# EAGLE design Token (EAGLE 6.5.0)
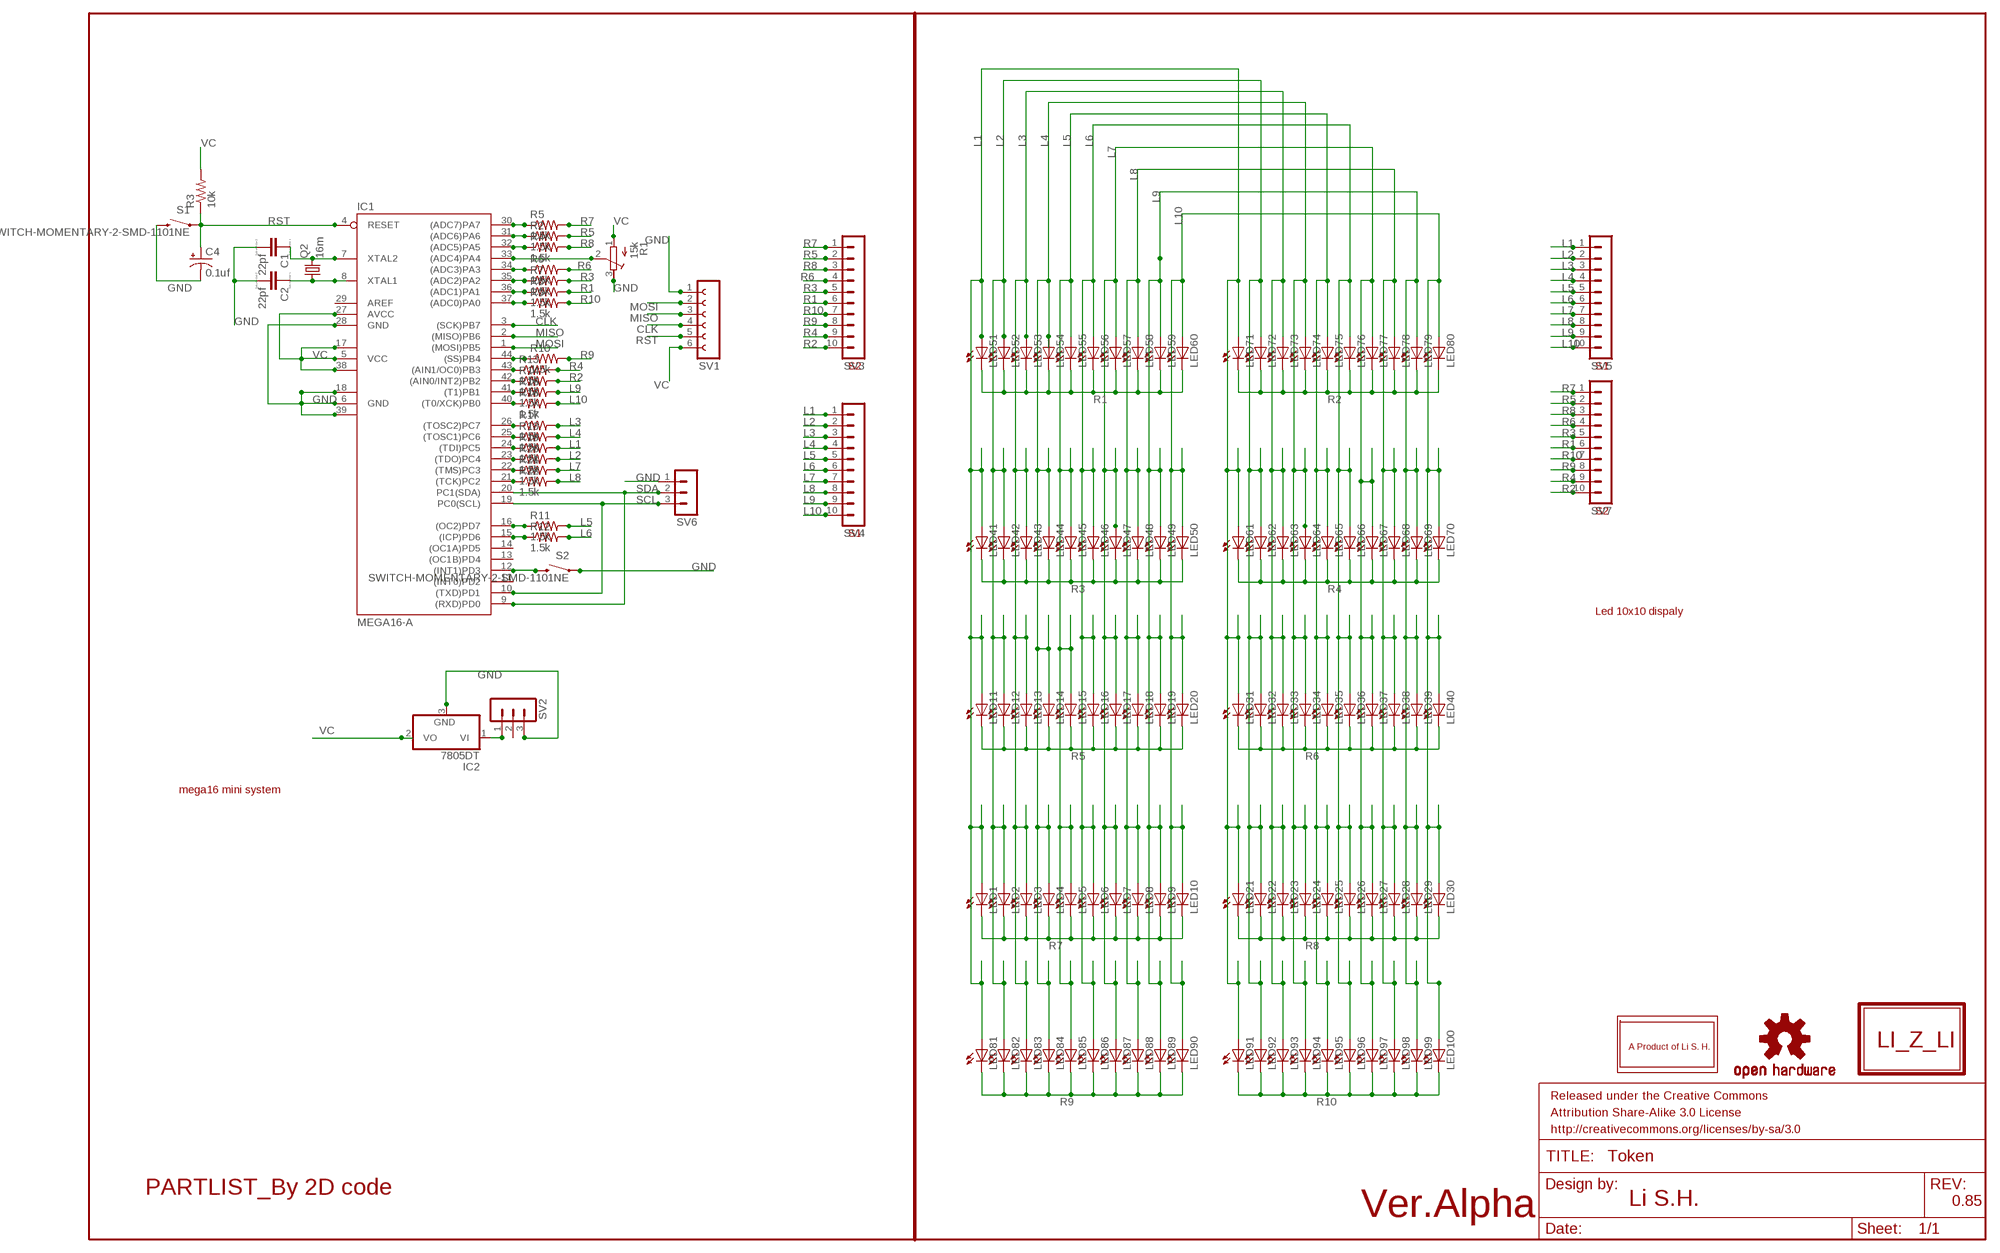
[diagram p0: schematic, sheet 1]

## Parts
C1  22pf  CC0402  [C0402]
C2  22pf  CC0402  [C0402]
C4  0.1uf  CPOL-USD/7343-31W  [D/7343-31W]
FRAME1  FRAME-LEDGER  [CREATIVE_COMMONS]
IC1  MEGA16-A  [TQFP44]
IC2  7805DT  [TO252]
LED1  LEDCHIPLED_0805  [CHIPLED_0805]
LED2  LEDCHIPLED_0805  [CHIPLED_0805]
LED3  LEDCHIPLED_0805  [CHIPLED_0805]
LED4  LEDCHIPLED_0805  [CHIPLED_0805]
LED5  LEDCHIPLED_0805  [CHIPLED_0805]
LED6  LEDCHIPLED_0805  [CHIPLED_0805]
LED7  LEDCHIPLED_0805  [CHIPLED_0805]
LED8  LEDCHIPLED_0805  [CHIPLED_0805]
LED9  LEDCHIPLED_0805  [CHIPLED_0805]
LED10  LEDCHIPLED_0805  [CHIPLED_0805]
LED11  LEDCHIPLED_0805  [CHIPLED_0805]
LED12  LEDCHIPLED_0805  [CHIPLED_0805]
LED13  LEDCHIPLED_0805  [CHIPLED_0805]
LED14  LEDCHIPLED_0805  [CHIPLED_0805]
LED15  LEDCHIPLED_0805  [CHIPLED_0805]
LED16  LEDCHIPLED_0805  [CHIPLED_0805]
LED17  LEDCHIPLED_0805  [CHIPLED_0805]
LED18  LEDCHIPLED_0805  [CHIPLED_0805]
LED19  LEDCHIPLED_0805  [CHIPLED_0805]
LED20  LEDCHIPLED_0805  [CHIPLED_0805]
LED21  LEDCHIPLED_0805  [CHIPLED_0805]
LED22  LEDCHIPLED_0805  [CHIPLED_0805]
LED23  LEDCHIPLED_0805  [CHIPLED_0805]
LED24  LEDCHIPLED_0805  [CHIPLED_0805]
LED25  LEDCHIPLED_0805  [CHIPLED_0805]
LED26  LEDCHIPLED_0805  [CHIPLED_0805]
LED27  LEDCHIPLED_0805  [CHIPLED_0805]
LED28  LEDCHIPLED_0805  [CHIPLED_0805]
LED29  LEDCHIPLED_0805  [CHIPLED_0805]
LED30  LEDCHIPLED_0805  [CHIPLED_0805]
LED31  LEDCHIPLED_0805  [CHIPLED_0805]
LED32  LEDCHIPLED_0805  [CHIPLED_0805]
LED33  LEDCHIPLED_0805  [CHIPLED_0805]
LED34  LEDCHIPLED_0805  [CHIPLED_0805]
LED35  LEDCHIPLED_0805  [CHIPLED_0805]
LED36  LEDCHIPLED_0805  [CHIPLED_0805]
LED37  LEDCHIPLED_0805  [CHIPLED_0805]
LED38  LEDCHIPLED_0805  [CHIPLED_0805]
LED39  LEDCHIPLED_0805  [CHIPLED_0805]
LED40  LEDCHIPLED_0805  [CHIPLED_0805]
LED41  LEDCHIPLED_0805  [CHIPLED_0805]
LED42  LEDCHIPLED_0805  [CHIPLED_0805]
LED43  LEDCHIPLED_0805  [CHIPLED_0805]
LED44  LEDCHIPLED_0805  [CHIPLED_0805]
LED45  LEDCHIPLED_0805  [CHIPLED_0805]
LED46  LEDCHIPLED_0805  [CHIPLED_0805]
LED47  LEDCHIPLED_0805  [CHIPLED_0805]
LED48  LEDCHIPLED_0805  [CHIPLED_0805]
LED49  LEDCHIPLED_0805  [CHIPLED_0805]
LED50  LEDCHIPLED_0805  [CHIPLED_0805]
LED51  LEDCHIPLED_0805  [CHIPLED_0805]
LED52  LEDCHIPLED_0805  [CHIPLED_0805]
LED53  LEDCHIPLED_0805  [CHIPLED_0805]
LED54  LEDCHIPLED_0805  [CHIPLED_0805]
LED55  LEDCHIPLED_0805  [CHIPLED_0805]
LED56  LEDCHIPLED_0805  [CHIPLED_0805]
LED57  LEDCHIPLED_0805  [CHIPLED_0805]
LED58  LEDCHIPLED_0805  [CHIPLED_0805]
LED59  LEDCHIPLED_0805  [CHIPLED_0805]
LED60  LEDCHIPLED_0805  [CHIPLED_0805]
LED61  LEDCHIPLED_0805  [CHIPLED_0805]
LED62  LEDCHIPLED_0805  [CHIPLED_0805]
LED63  LEDCHIPLED_0805  [CHIPLED_0805]
LED64  LEDCHIPLED_0805  [CHIPLED_0805]
LED65  LEDCHIPLED_0805  [CHIPLED_0805]
LED66  LEDCHIPLED_0805  [CHIPLED_0805]
LED67  LEDCHIPLED_0805  [CHIPLED_0805]
LED68  LEDCHIPLED_0805  [CHIPLED_0805]
LED69  LEDCHIPLED_0805  [CHIPLED_0805]
LED70  LEDCHIPLED_0805  [CHIPLED_0805]
LED71  LEDCHIPLED_0805  [CHIPLED_0805]
LED72  LEDCHIPLED_0805  [CHIPLED_0805]
LED73  LEDCHIPLED_0805  [CHIPLED_0805]
LED74  LEDCHIPLED_0805  [CHIPLED_0805]
LED75  LEDCHIPLED_0805  [CHIPLED_0805]
LED76  LEDCHIPLED_0805  [CHIPLED_0805]
LED77  LEDCHIPLED_0805  [CHIPLED_0805]
LED78  LEDCHIPLED_0805  [CHIPLED_0805]
LED79  LEDCHIPLED_0805  [CHIPLED_0805]
LED80  LEDCHIPLED_0805  [CHIPLED_0805]
LED81  LEDCHIPLED_0805  [CHIPLED_0805]
LED82  LEDCHIPLED_0805  [CHIPLED_0805]
LED83  LEDCHIPLED_0805  [CHIPLED_0805]
LED84  LEDCHIPLED_0805  [CHIPLED_0805]
LED85  LEDCHIPLED_0805  [CHIPLED_0805]
LED86  LEDCHIPLED_0805  [CHIPLED_0805]
LED87  LEDCHIPLED_0805  [CHIPLED_0805]
LED88  LEDCHIPLED_0805  [CHIPLED_0805]
LED89  LEDCHIPLED_0805  [CHIPLED_0805]
LED90  LEDCHIPLED_0805  [CHIPLED_0805]
LED91  LEDCHIPLED_0805  [CHIPLED_0805]
LED92  LEDCHIPLED_0805  [CHIPLED_0805]
LED93  LEDCHIPLED_0805  [CHIPLED_0805]
LED94  LEDCHIPLED_0805  [CHIPLED_0805]
LED95  LEDCHIPLED_0805  [CHIPLED_0805]
LED96  LEDCHIPLED_0805  [CHIPLED_0805]
LED97  LEDCHIPLED_0805  [CHIPLED_0805]
LED98  LEDCHIPLED_0805  [CHIPLED_0805]
LED99  LEDCHIPLED_0805  [CHIPLED_0805]
LED100  LEDCHIPLED_0805  [CHIPLED_0805]
LOGO1  OSHW-LOGOS  [OSHW-LOGO-S]
Q2  16m  CRYSTALHC49UP  [HC49UP]
R1  15k  R-TRIMM64W  [RTRIM64W]
R2  1.5k  R-US_R0201  [R0201]
R3  10k  R-US_R0201  [R0201]
R4  1.5k  R-US_R0201  [R0201]
R5  1.5k  R-US_R0201  [R0201]
R6  1.5k  R-US_R0201  [R0201]
R7  1.5k  R-US_R0201  [R0201]
R8  1.5k  R-US_R0201  [R0201]
R9  1.5k  R-US_R0201  [R0201]
R10  1.5k  R-US_R0201  [R0201]
R11  1.5k  R-US_R0201  [R0201]
R12  1.5k  R-US_R0201  [R0201]
R13  1.5k  R-US_R0201  [R0201]
R14  1.5k  R-US_R0201  [R0201]
R15  1.5k  R-US_R0201  [R0201]
R16  1.5k  R-US_R0201  [R0201]
R17  1.5k  R-US_R0201  [R0201]
R18  1.5k  R-US_R0201  [R0201]
R19  1.5k  R-US_R0201  [R0201]
R20  1.5k  R-US_R0201  [R0201]
R21  1.5k  R-US_R0201  [R0201]
R22  1.5k  R-US_R0201  [R0201]
S1  SWITCH-MOMENTARY-2-SMD-1101NE  [TACTILE-SWITCH-1101NE]
S2  SWITCH-MOMENTARY-2-SMD-1101NE  [TACTILE-SWITCH-1101NE]
SV1  FE06-1  [FE06]
SV2  MA03-1  [MA03-1]
SV3  MA10-1  [MA10-1]
SV4  MA10-1  [MA10-1]
SV5  MA10-1  [MA10-1]
SV6  MA03-1  [MA03-1]
SV7  MA10-1  [MA10-1]
U$1  NO1  [NO1]
U$2  NO2  [NO2]
U$3  VERALPHA  [VERALPHA]
U$4  PARTIST-2DCODE  [PARTLIST-2DCODE]

## Nets
CLK: IC1.3((SCK)PB7) SV1.4
GND: C1.2 C2.2 C4.- IC1.6(GND) IC1.18(GND1) IC1.28(GND) IC1.39(GND2) IC2.3(GND) R1.3(A) S1.P$2 S2.P$1 SV1.1 SV2.3 SV6.1
L1: LED1.A LED11.A LED21.A LED31.A LED41.A LED51.A LED61.A LED71.A LED81.A LED91.A SV5.1
L2: LED2.A LED12.A LED22.A LED32.A LED42.A LED52.A LED62.A LED72.A LED82.A LED92.A SV5.2
L3: LED3.A LED13.A LED23.A LED33.A LED43.A LED53.A LED63.A LED73.A LED83.A LED93.A SV5.3
L4: LED4.A LED14.A LED24.A LED34.A LED44.A LED54.A LED64.A LED74.A LED84.A LED94.A SV5.4
L5: LED5.A LED15.A LED25.A LED35.A LED45.A LED55.A LED65.A LED75.A LED85.A LED95.A SV5.5
L6: LED6.A LED16.A LED26.A LED36.A LED46.A LED56.A LED66.A LED76.A LED86.A LED96.A SV5.6
L7: LED7.A LED17.A LED27.A LED37.A LED47.A LED57.A LED67.A LED77.A LED87.A LED97.A SV5.7
L8: LED8.A LED18.A LED28.A LED38.A LED48.A LED58.A LED68.A LED78.A LED88.A LED98.A SV5.8
L9: LED9.A LED19.A LED29.A LED39.A LED49.A LED59.A LED69.A LED79.A LED89.A LED99.A SV5.9
L10: LED10.A LED20.A LED30.A LED40.A LED50.A LED60.A LED70.A LED80.A LED90.A LED100.A SV5.10
MISO: IC1.2((MISO)PB6) SV1.3
MOSI: IC1.1((MOSI)PB5) SV1.2
N$1: IC1.30((ADC7)PA7) R5.1
N$2: IC1.43((AIN1/OC0)PB3) R13.1
N$3: IC1.42((AIN0/INT2)PB2) R14.1
N$4: IC1.41((T1)PB1) R15.1
N$5: IC1.31((ADC6)PA6) R2.1
N$6: IC1.32((ADC5)PA5) R4.1
N$7: IC1.33((ADC4)PA4) R1.2(S)
N$8: IC1.34((ADC3)PA3) R6.1
N$9: C2.1 IC1.8(XTAL1) Q2.1
N$10: C1.1 IC1.7(XTAL2) Q2.2
N$11: IC1.35((ADC2)PA2) R7.1
N$12: IC1.36((ADC1)PA1) R8.1
N$13: IC2.1(VI) SV2.1
N$14: IC1.37((ADC0)PA0) R9.1
N$15: IC1.12((INT1)PD3) S2.P$2
N$16: IC1.44((SS)PB4) R10.1
N$17: IC1.16((OC2)PD7) R11.1
N$18: IC1.15((ICP)PD6) R12.1
N$19: IC1.40((T0/XCK)PB0) R16.1
N$20: IC1.26((TOSC2)PC7) R17.1
N$21: IC1.25((TOSC1)PC6) R18.1
N$22: IC1.24((TDI)PC5) R19.1
N$23: IC1.23((TDO)PC4) R20.1
N$24: IC1.22((TMS)PC3) R21.1
N$25: IC1.21((TCK)PC2) R22.1
N$30: R5.2 SV3.1
N$31: R2.2 SV3.2
N$32: R4.2 SV3.3
N$33: R6.2 SV3.4
N$34: R7.2 SV3.5
N$35: R8.2 SV3.6
N$36: R9.2 SV3.7
N$37: R10.2 SV3.8
N$38: R13.2 SV3.9
N$39: R14.2 SV3.10
N$40: R15.2 SV4.9
N$41: R16.2 SV4.10
N$42: R17.2 SV4.3
N$43: R18.2 SV4.4
N$44: R19.2 SV4.1
N$45: R20.2 SV4.2
N$46: R21.2 SV4.7
N$47: R22.2 SV4.8
N$48: R11.2 SV4.5
N$49: R12.2 SV4.6
R1: LED51.C LED52.C LED53.C LED54.C LED55.C LED56.C LED57.C LED58.C LED59.C LED60.C SV7.6
R2: LED71.C LED72.C LED73.C LED74.C LED75.C LED76.C LED77.C LED78.C LED79.C LED80.C SV7.10
R3: LED41.C LED42.C LED43.C LED44.C LED45.C LED46.C LED47.C LED48.C LED49.C LED50.C SV7.5
R4: LED61.C LED62.C LED63.C LED64.C LED65.C LED66.C LED67.C LED68.C LED69.C LED70.C SV7.9
R5: LED11.C LED12.C LED13.C LED14.C LED15.C LED16.C LED17.C LED18.C LED19.C LED20.C SV7.2
R6: LED31.C LED32.C LED33.C LED34.C LED35.C LED36.C LED37.C LED38.C LED39.C LED40.C SV7.4
R7: LED1.C LED2.C LED3.C LED4.C LED5.C LED6.C LED7.C LED8.C LED9.C LED10.C SV7.1
R8: LED21.C LED22.C LED23.C LED24.C LED25.C LED26.C LED27.C LED28.C LED29.C LED30.C SV7.3
R9: LED81.C LED82.C LED83.C LED84.C LED85.C LED86.C LED87.C LED88.C LED89.C LED90.C SV7.8
R10: LED91.C LED92.C LED93.C LED94.C LED95.C LED96.C LED97.C LED98.C LED99.C LED100.C SV7.7
RST: C4.+ IC1.4(RESET) R3.1 S1.P$1 SV1.5
SCL: IC1.10((TXD)PD1) IC1.19(PC0(SCL)) SV6.3
SDA: IC1.9((RXD)PD0) IC1.20(PC1(SDA)) SV6.2
VC: IC1.5(VCC) IC1.17(VCC1) IC1.27(AVCC) IC1.38(VCC2) IC2.2(VO) R1.1(E) R3.2 SV1.6
Unconnected: IC1.11((INT0)PD2) IC1.13((OC1B)PD4) IC1.14((OC1A)PD5) IC1.29(AREF) SV2.2

## Notes on the sheet
- S2 | S1
- S2
- S1
- Led 10x10 dispaly
- mega16 mini system
- Li S.H. | 0.85

## Library data of the parts
C1 C2 = eagle-ltspice:C: CAPACITOR, European symbol; SPICEMODEL: NONE; SPICEPREFIX: C
C4 = adafruit:CPOL-US: POLARIZED CAPACITOR, American symbol
FRAME1 = SparkFun-Aesthetics:FRAME-LEDGER: Schematic Frame Standard 11x14 US Ledger frame
IC1 = atmel:MEGA16: MICROCONTROLLER 16 Kbytes FLASH 1 kbytes SRAM 512 bytes EEPROM USART 8-channel 10 bit ADC Source: avr.lbr; MPN: ATMEGA16-16AU; OC_FARNELL: 9171134; OC_NEWARK: 96K6515
IC2 = adafruit:78*: Positive VOLTAGE REGULATOR Added bigger pads to the TO-92 package
LED1-LED100 = led:LED: LED OSRAM: - CHIPLED LG R971, LG N971, LY N971, LG Q971, LY Q971, LO R971, LY R971 LH N974, LH R974 LS Q976, LO Q976, LY Q976 LO Q996 - Hyper CHIPLED LW Q18S LB Q993, LB Q99A, LB R99A - SideLED LS A670, LO A670, LY A670, LG A670, LP A670 LB A673, LV A673, LT A673, LW A673 LH A674 LY A675 LS A676, LA A676, LO A676, LY A676, LW A676 LS A679, LY A679, LG A679 - Hyper Micro SIDELED® LS Y876, LA Y876, LO Y876, LY Y876 LT Y87S - SmartLED LW L88C, LW L88S LB L89C, LB L89S, LG L890 LS L89K, LO L89K, LY L89K LS L896, LA L896, LO L896, LY L896 - TOPLED LS T670, LO T670, LY T670, LG T670, LP T670 LSG T670, LSP T670, LSY T670, LOP T670, LYG T670 LG T671, LOG T671, LSG T671 LB T673, LV T673, LT T673, LW T673 LH T674 LS T676, LA T676, LO T676, LY T676, LB T676, LH T676, LSB T676, LW T676 LB T67C, LV T67C, LT T67C, LS T67K, LO T67K, LY T67K, LW E67C LS E67B, LA E67B, LO E67B, LY E67B, LB E67C, LV E67C, LT E67C LW T67C LS T679, LY T679, LG T679 LS T770, LO T770, LY T770, LG T770, LP T770 LB T773, LV T773, LT T773, LW T773 LH T774 LS E675, LA E675, LY E675, LS T675 LS T776, LA T776, LO T776, LY T776, LB T776 LHGB T686 LT T68C, LB T68C - Hyper Mini TOPLED® LB M676 - Mini TOPLED Santana® LG M470 LS M47K, LO M47K, LY M47K Source: http://www.osram.convergy.de LUXEON: - LUMILED® LXK2-PW12-R00, LXK2-PW12-S00, LXK2-PW14-U00, LXK2-PW14-V00 LXK2-PM12-R00, LXK2-PM12-S00, LXK2-PM14-U00 LXK2-PE12-Q00, LXK2-PE12-R00, LXK2-PE12-S00, LXK2-PE14-T00, LXK2-PE14-U00 LXK2-PB12-K00, LXK2-PB12-L00, LXK2-PB12-M00, LXK2-PB14-N00, LXK2-PB14-P00, LXK2-PB14-Q00 LXK2-PR12-L00, LXK2-PR12-M00, LXK2-PR14-Q00, LXK2-PR14-R00 LXK2-PD12-Q00, LXK2-PD12-R00, LXK2-PD12-S00 LXK2-PH12-R00, LXK2-PH12-S00 LXK2-PL12-P00, LXK2-PL12-Q00, LXK2-PL12-R00 Source: www.luxeon.com KINGBRIGHT: KA-3528ASYC Source: www.kingbright.com
LOGO1 = SparkFun-Aesthetics:OSHW-LOGO: Open Source Hardware Logo This logo indicates the piece of hardware it is found on incorporates a OSHW license and/or adheres to the definition of open source hardware found here: http://freedomdefined.org/OSHW
Q2 = crystal:CRYSTAL: CRYSTAL; OC_FARNELL: unknown; OC_NEWARK: unknown
R1 = resistor:R-TRIMM: Trimm resistor
R2-R22 = rcl:R-US_: RESISTOR, American symbol
S1 S2 = SparkFun-Electromechanical:SWITCH-MOMENTARY-2: Various NO switches- pushbuttons, reed, etc
SV1 = con-lsta:FE06-1: FEMALE HEADER; OC_FARNELL: unknown; OC_NEWARK: unknown
SV2 SV6 = con-lstb:MA03-1: PIN HEADER; OC_FARNELL: unknown; OC_NEWARK: unknown
SV3-SV5 SV7 = con-lstb:MA10-1: PIN HEADER; OC_FARNELL: unknown; OC_NEWARK: unknown
U$1 = logo_self:NO1
U$2 = logo_self:NO2
U$3 = logo_self:VERALPHA
U$4 = 2Dcode:PARTIST-2DCODE

## Board
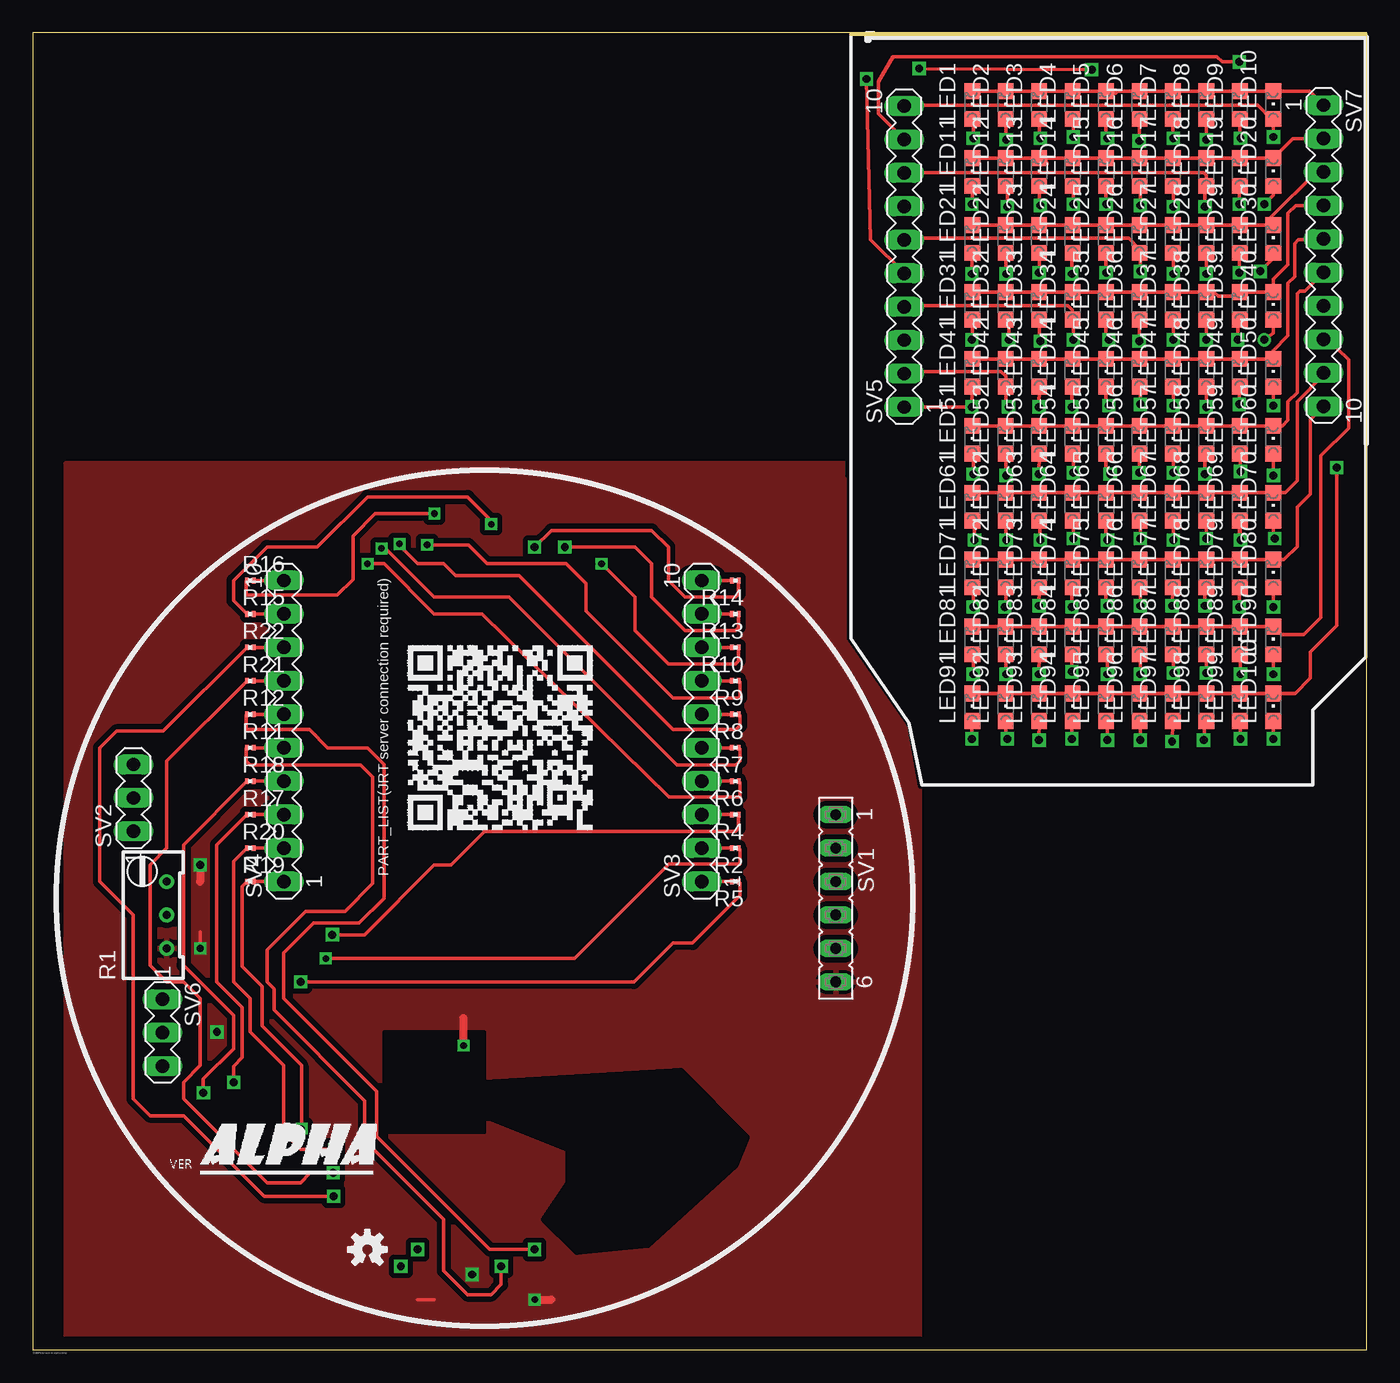
[diagram p1: board, top side]
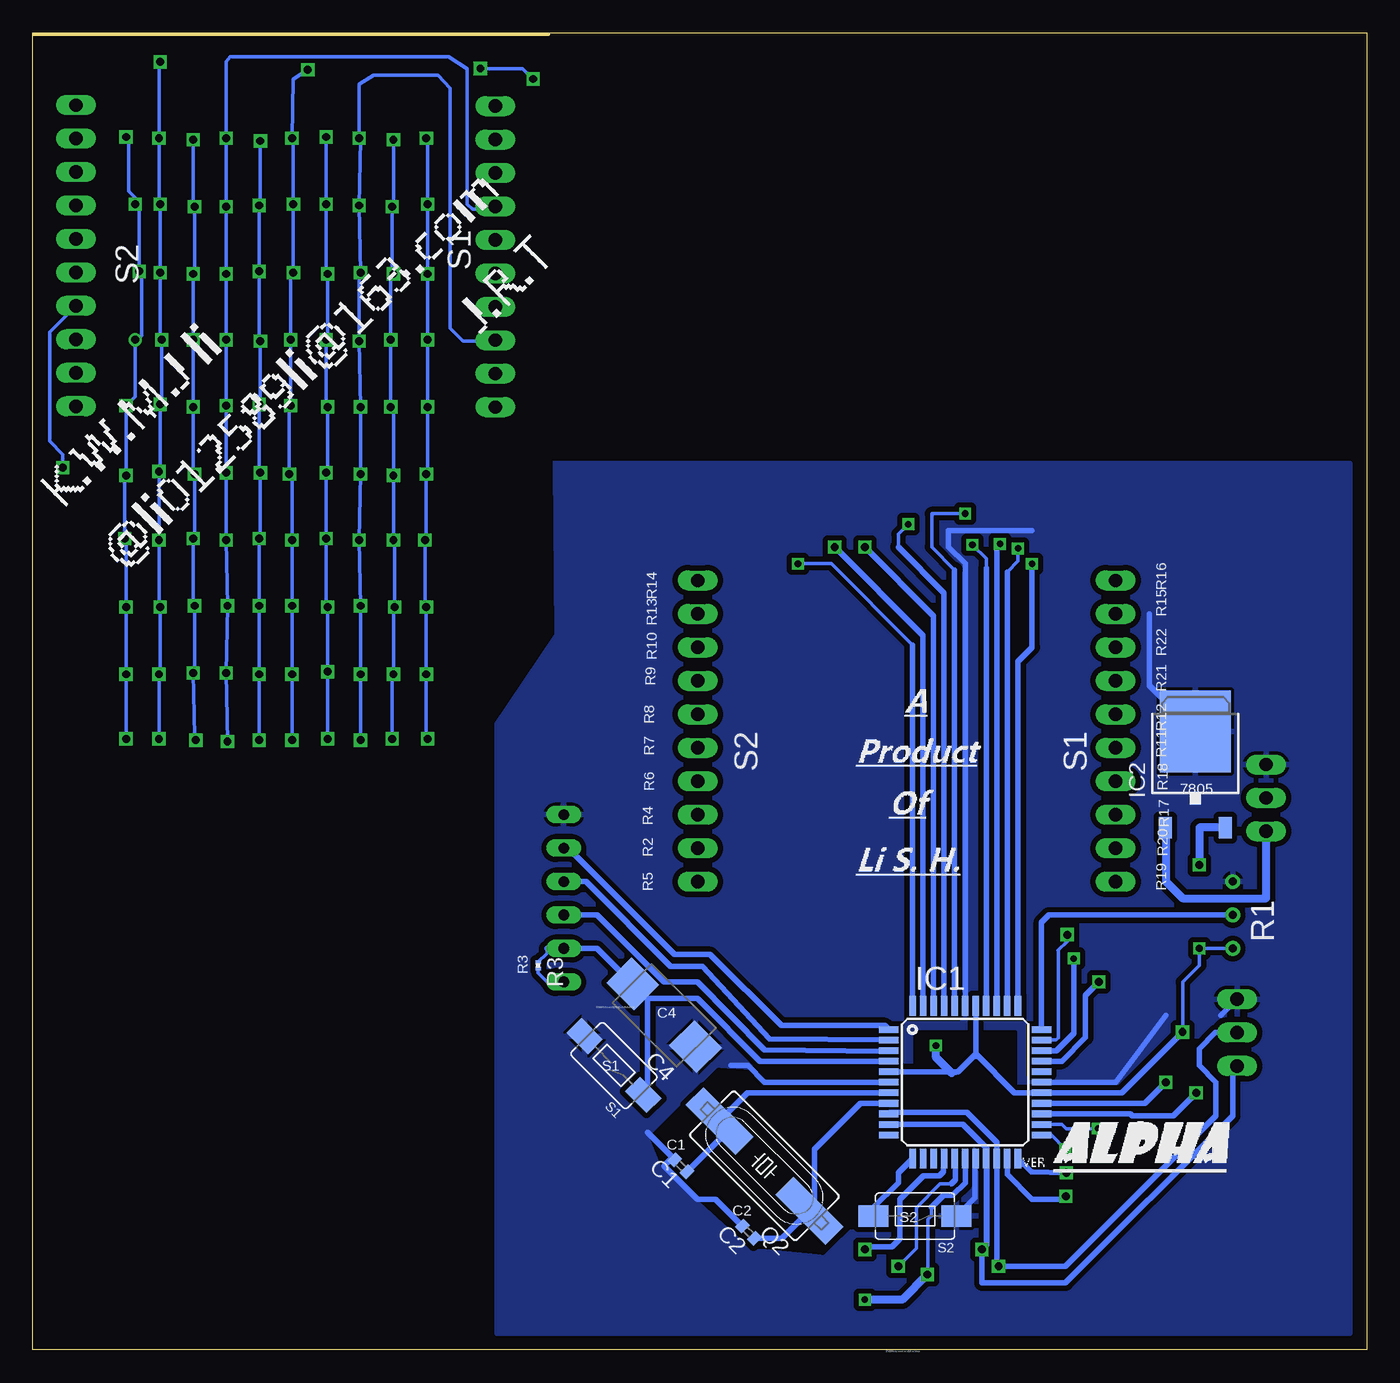
[diagram p2: board, bottom side, seen from below]

Size 101.27 x 100 mm. Coordinates in mm from the lower left corner, seen from the top.
Outline: 62.1,99.9 101.2,99.9
Outline: 0,0 101.27,0 101.27,100 0,100 0,0
Copper layers (1*16): Top 0.035mm / dielectric 1.5mm / Bottom 0.035mm
Design rules "default": minimum track width 10mil, minimum drill 24mil, track to track 8mil, track to pad 8mil, pad to pad 8mil, via to via 8mil, smd to smd 8mil, copper to edge 40mil, drill to drill 8mil, minimum pad ring 10mil, minimum via ring 8mil, stop-mask expansion 4mil, vias tented up to drill 0mil, thermal gap 10mil

### Footprints (pad centres in the part's own frame; a part is rotated, then mirrored left to right if it is on the bottom)
C0402 = smd 0.7 x 0.9: 1 -0.65,0; 2 0.65,0
D/7343-31W = smd 2.95 x 2.7: + 3.375,0; - -3.375,0
TQFP44 = smd 1.5 x 0.5: 1 -5.8,4; 2 -5.8,3.2; 3 -5.8,2.4; 4 -5.8,1.6; 5 -5.8,0.8; 6 -5.8,0; 7 -5.8,-0.8; 8 -5.8,-1.6; 9 -5.8,-2.4; 10 -5.8,-3.2; 11 -5.8,-4; 23 5.8,-4; 24 5.8,-3.2; 25 5.8,-2.4; 26 5.8,-1.6; 27 5.8,-0.8; 28 5.8,0; 29 5.8,0.8; 30 5.8,1.6; 31 5.8,2.4; 32 5.8,3.2; 33 5.8,4 | smd 0.5 x 1.5: 12 -4,-5.8; 13 -3.2,-5.8; 14 -2.4,-5.8; 15 -1.6,-5.8; 16 -0.8,-5.8; 17 0,-5.8; 18 0.8,-5.8; 19 1.6,-5.8; 20 2.4,-5.8; 21 3.2,-5.8; 22 4,-5.8; 34 4,5.8; 35 3.2,5.8; 36 2.4,5.8; 37 1.6,5.8; 38 0.8,5.8; 39 0,5.8; 40 -0.8,5.8; 41 -1.6,5.8; 42 -2.4,5.8; 43 -3.2,5.8; 44 -4,5.8
TO252 = smd 1 x 1.6: 1 -2.28,-4.8; 2 2.28,-4.8 | smd 5.4 x 6.2: 3 0,2.5
CHIPLED_0805 = smd 1.2 x 1.2: A 0,-1.05; C 0,1.05
HC49UP = smd 5.334 x 1.93: 1 -4.826,0; 2 4.826,0
RTRIM64W = drill 0.61: 1 1.27,-2.54; 2 1.27,0; 3 1.27,2.54
R0201 = smd 0.28 x 0.43: 1 -0.255,0; 2 0.255,0
TACTILE-SWITCH-1101NE = smd 2.3 x 1.6: P$1 -3.15,0; P$2 3.15,0
FE06 = drill 0.813 long: 1 -6.35,0; 2 -3.81,0; 3 -1.27,0; 4 1.27,0; 5 3.81,0; 6 6.35,0
MA03-1 = drill 1.016 long: 1 -2.54,0; 2 0,0; 3 2.54,0
MA10-1 = drill 1.016 long: 1 -11.43,0; 2 -8.89,0; 3 -6.35,0; 4 -3.81,0; 5 -1.27,0; 6 1.27,0; 7 3.81,0; 8 6.35,0; 9 8.89,0; 10 11.43,0

### Placement (x,y rotation side)
C1  52.07,13.97 135 bottom
C2  46.94,8.94 135 bottom
C4  53.34,25.4 135 bottom
FRAME1  30.23,9.03 180 bottom
IC1  30.48,20.32 0 bottom
IC2  13,44.45 0 bottom
LED1  71.33,94.51 0 top
LED2  73.87,94.51 0 top
LED3  76.41,94.51 0 top
LED4  78.95,94.51 0 top
LED5  81.49,94.51 0 top
LED6  84.03,94.51 0 top
LED7  86.57,94.51 0 top
LED8  89.11,94.51 0 top
LED9  91.65,94.51 0 top
LED10  94.19,94.51 0 top
LED11  71.33,89.43 0 top
LED12  73.87,89.43 0 top
LED13  76.41,89.43 0 top
LED14  78.95,89.43 0 top
LED15  81.49,89.43 0 top
LED16  84.03,89.43 0 top
LED17  86.57,89.43 0 top
LED18  89.11,89.43 0 top
LED19  91.65,89.43 0 top
LED20  94.19,89.43 0 top
LED21  71.33,84.35 0 top
LED22  73.87,84.35 0 top
LED23  76.41,84.35 0 top
LED24  78.95,84.35 0 top
LED25  81.49,84.35 0 top
LED26  84.03,84.35 0 top
LED27  86.57,84.35 0 top
LED28  89.11,84.35 0 top
LED29  91.65,84.35 0 top
LED30  94.19,84.35 0 top
LED31  71.33,79.27 0 top
LED32  73.87,79.27 0 top
LED33  76.41,79.27 0 top
LED34  78.95,79.27 0 top
LED35  81.49,79.27 0 top
LED36  84.03,79.27 0 top
LED37  86.57,79.27 0 top
LED38  89.11,79.27 0 top
LED39  91.65,79.27 0 top
LED40  94.19,79.27 0 top
LED41  71.33,74.19 0 top
LED42  73.87,74.19 0 top
LED43  76.41,74.19 0 top
LED44  78.95,74.19 0 top
LED45  81.49,74.19 0 top
LED46  84.03,74.19 0 top
LED47  86.57,74.19 0 top
LED48  89.11,74.19 0 top
LED49  91.65,74.19 0 top
LED50  94.19,74.19 0 top
LED51  71.33,69.11 0 top
LED52  73.87,69.11 0 top
LED53  76.41,69.11 0 top
LED54  78.95,69.11 0 top
LED55  81.49,69.11 0 top
LED56  84.03,69.11 0 top
LED57  86.57,69.11 0 top
LED58  89.11,69.11 0 top
LED59  91.65,69.11 0 top
LED60  94.19,69.11 0 top
LED61  71.33,64.03 0 top
LED62  73.87,64.03 0 top
LED63  76.41,64.03 0 top
LED64  78.95,64.03 0 top
LED65  81.49,64.03 0 top
LED66  84.03,64.03 0 top
LED67  86.57,64.03 0 top
LED68  89.11,64.03 0 top
LED69  91.65,64.03 0 top
LED70  94.19,64.03 0 top
LED71  71.33,58.95 0 top
LED72  73.87,58.95 0 top
LED73  76.41,58.95 0 top
LED74  78.95,58.95 0 top
LED75  81.49,58.95 0 top
LED76  84.03,58.95 0 top
LED77  86.57,58.95 0 top
LED78  89.11,58.95 0 top
LED79  91.65,58.95 0 top
LED80  94.19,58.95 0 top
LED81  71.33,53.87 0 top
LED82  73.87,53.87 0 top
LED83  76.41,53.87 0 top
LED84  78.95,53.87 0 top
LED85  81.49,53.87 0 top
LED86  84.03,53.87 0 top
LED87  86.57,53.87 0 top
LED88  89.11,53.87 0 top
LED89  91.65,53.87 0 top
LED90  94.19,53.87 0 top
LED91  71.33,48.79 0 top
LED92  73.87,48.79 0 top
LED93  76.41,48.79 0 top
LED94  78.95,48.79 0 top
LED95  81.49,48.79 0 top
LED96  84.03,48.79 0 top
LED97  86.57,48.79 0 top
LED98  89.11,48.79 0 top
LED99  91.65,48.79 0 top
LED100  94.19,48.79 0 top
LOGO1  25.4,7.62 0 top
Q2  45.72,13.97 135 bottom
R1  8.89,33.02 0 top
R2  53.34,38.1 180 top
R3  62.9,29.19 270 bottom
R4  53.34,40.64 180 top
R5  53.34,35.56 180 top
R6  53.34,43.18 180 top
R7  53.34,45.72 180 top
R8  53.34,48.26 180 top
R9  53.34,50.8 180 top
R10  53.34,53.34 180 top
R11  16.51,45.72 0 top
R12  16.51,48.26 0 top
R13  53.34,55.88 180 top
R14  53.34,58.42 180 top
R15  16.51,55.88 0 top
R16  16.51,58.42 0 top
R17  16.51,40.64 0 top
R18  16.51,43.18 0 top
R19  16.51,35.56 0 top
R20  16.51,38.1 0 top
R21  16.51,50.8 0 top
R22  16.51,53.34 0 top
S1  57.15,21.59 135 bottom
S2  34.29,10.16 180 bottom
SV1  60.96,34.29 270 top
SV2  7.62,41.91 90 top
SV3  50.8,46.99 90 top
SV4  19.05,46.99 90 top
SV5  66.17,83.02 90 top
SV6  9.83,24.09 270 top
SV7  98,83.08 270 top
U$1  88.5,55.38 45 bottom
U$2  58.5,26.25 0 bottom
U$3  36.5,0.12 0 bottom
U$4  28,39 0 top

### Tracks (layer width: path | path; a pad name or v marks a point on that pad's centre or on a via)
CLK
  Bottom 0.406: IC1.3 36.42,22.66 45.72,22.76 50.8,27.94 53.34,27.94 58.42,33.02 SV1.4
GND
  Bottom 0.406: C2.2 49.43,11.43 50.8,11.43 53.34,13.97 52.88,14.43 C1.2 54.61,16.51 | 54.61,16.51 | 30.48,27.94 IC1.39 30.48,59.69 31.75,60.96 31.75,62.23 25.4,62.23 | 22.86,20.32 IC1.28 19.05,20.32 15.24,25.4 | IC1.6 45.72,20.32 46.99,21.59 48.26,21.59 | IC1.18 29.74,14.46 29.74,11.56 S2.P$1 | 16.51,55.88 16.51,50.46 IC2.3 | 11.06,25.4 SV6.1
  pour Bottom (isolate 0.406): 1.27,1.27 1.27,67.31 66.04,67.31 66.04,1.27
L1  (via drill 0.6)
  Top 0.254: LED1.A 71.4,93.39 v71.4,92 | v71.3,87 71.33,87.03 LED11.A | LED21.A 71.3,83.28 v71.3,81.7 | v71.3,76.7 71.33,76.73 LED31.A | LED41.A 71.3,73.11 v71.3,71.6 SV5.1 | LED51.A 71.4,67.99 v71.4,66.5 | LED61.A 71.5,62.81 v71.5,61.5 | LED71.A 71.4,57.83 v71.4,56.4 | LED81.A 71.4,52.75 v71.4,51.3 | LED91.A 71.3,47.72 v71.3,46.4
  Bottom 0.254: v71.4,92 71.3,91.9 v71.3,87 v71.3,81.7 v71.3,76.7 v71.3,71.6 71.3,66.6 v71.4,66.5 71.4,61.6 v71.5,61.5 71.5,56.5 v71.4,56.4 v71.4,51.3 71.4,46.6 v71.3,46.4
L2  (via drill 0.6)
  Top 0.254: SV5.2 66.33,74.3 73.5,74.3 73.87,73.93 LED42.A 73.87,72.13 74,72 74,71.7 v74.1,71.6 | LED2.A 73.9,93.43 v73.9,91.9 | LED12.A 74,88.25 v74,86.8 | LED22.A 73.9,83.27 v73.9,81.7 | LED32.A 74.1,77.99 v74.1,76.7 | LED52.A 73.87,66.43 v73.9,66.4 | LED62.A 73.87,61.53 v73.9,61.5 | LED72.A 73.87,56.47 v73.8,56.4 | LED82.A 73.87,51.33 v73.9,51.3 | LED92.A 73.87,46.53 v74,46.4
  Bottom 0.254: v73.9,91.9 73.9,86.9 v74,86.8 74,81.8 v73.9,81.7 74.1,81.5 v74.1,76.7 v74.1,71.6 73.9,71.4 v73.9,66.4 v73.9,61.5 73.8,61.4 v73.8,56.4 73.9,56.3 v73.9,51.3 74,51.2 v74,46.4
L3  (via drill 0.6)
  Top 0.254: v76.5,92 76.41,92.09 LED3.A | LED13.A 76.41,86.71 v76.5,86.9 | LED23.A 76.41,81.61 v76.4,81.8 | LED33.A 76.41,76.69 v76.5,76.6 | LED43.A v76.4,71.6 | LED53.A v76.4,66.5 | LED63.A v76.5,61.5 | LED73.A v76.4,56.5 | LED83.A v76.4,51.3 | LED93.A v76.4,46.3
  Bottom 0.254: SV5.3 66.23,76.6 68.6,76.6 69.6,77.6 69.6,95.8 70.5,96.8 75.4,96.8 76.5,96.1 v76.5,92 76.4,91.9 v76.5,86.9 v76.4,81.8 76.5,81.5 v76.5,76.6 v76.4,71.6 v76.4,66.5 v76.5,61.5 v76.4,56.5 v76.4,51.3 v76.4,46.3
L4  (via drill 0.6)
  Top 0.254: SV5.4 66.25,79.3 78.6,79.3 78.95,78.95 LED34.A arc-90 79,78.17 v79,76.7 | LED14.A arc-90 79,88.33 v79,87 | LED24.A arc90 78.9,83.25 v78.9,81.7 | LED44.A arc90 78.9,73.09 v78.9,71.6 | LED54.A arc-90 79,68.01 v79,66.6 | LED64.A arc-90 79,62.93 v79,61.6 | LED74.A arc90 78.9,57.85 v78.9,56.4 | LED84.A arc90 78.9,52.77 v78.9,51.5 | LED94.A arc90 78.9,47.7 v78.9,46.4 | v79,92.1 79,93.41 LED4.A
  Bottom 0.254: v79,92.1 v79,87 79,81.8 arc-90 v78.9,81.7 78.9,76.8 arc90 v79,76.7 79,71.7 arc-90 v78.9,71.6 78.9,66.7 arc90 v79,66.6 v79,61.6 79,56.7 arc-90 v78.9,56.4 v78.9,51.5 v78.9,46.4
L5  (via drill 0.6)
  Top 0.254: SV5.5 63.6,84.31 v63.3,96.5 | v67.3,97.3 v80.4,97.2 | v81.6,92 81.49,92.11 LED5.A | LED15.A 81.49,87 v81.5,87 | LED25.A 81.49,81.8 v81.5,81.8 | LED35.A 81.49,76.7 v81.7,76.7 | LED45.A 81.49,71.7 v81.7,71.7 | LED55.A 81.49,66.5 v81.8,66.5 | LED65.A 81.49,61.5 v81.6,61.5 | LED75.A 81.49,56.5 v81.6,56.5 | LED85.A arc-90 81.6,52.71 v81.6,51.3 | LED95.A arc-90 81.6,47.63 v81.6,46.3
  Bottom 0.254: v63.3,96.5 64.1,97.3 v67.3,97.3 | v80.4,97.2 81.5,96.5 v81.6,92 81.5,92 v81.5,87 v81.5,81.8 81.7,81.8 v81.7,76.7 v81.7,71.7 81.8,71.7 v81.8,66.5 81.6,66.5 v81.6,61.5 v81.6,56.5 v81.6,51.3 v81.6,46.3
L6  (via drill 0.6)
  Top 0.254: SV5.6 66.28,84.4 83.2,84.4 84.03,83.57 LED26.A arc-90 84.1,83.23 v84.1,81.9 | LED16.A arc-90 84.1,88.31 v84.1,86.9 | LED36.A arc90 84,78.19 v84,76.6 | LED46.A arc-90 84.1,73.07 v84.1,71.8 | LED56.A arc90 84,68.03 v84,66.6 | LED66.A arc-90 84.1,62.91 v84.1,61.6 | LED76.A arc-90 84.1,57.83 v84.1,56.5 | LED86.A arc-90 84.1,52.75 v84.1,51.3 | LED96.A arc-90 84.1,47.67 v84.1,46.3 | v84,91.8 84,93.44 LED6.A
  Bottom 0.254: v84.1,46.3 v84.1,51.3 v84.1,56.5 v84.1,61.6 arc-90 84,61.7 v84,66.6 arc90 84.1,66.7 v84.1,71.8 arc-90 84,71.9 v84,76.6 arc90 84.1,76.7 v84.1,81.9 v84.1,86.9 arc-90 84,87 v84,91.8
L7  (via drill 0.6)
  Top 0.254: v86.6,92 86.57,92.03 LED7.A | LED17.A arc-90 86.6,88.35 v86.6,86.8 | LED27.A arc-90 86.6,83.27 v86.6,81.7 | LED37.A arc-90 86.6,78.19 v86.6,76.7 | LED47.A arc-90 86.6,73.11 v86.6,71.7 | LED57.A arc-90 86.6,68.03 v86.6,66.6 | LED67.A arc-90 86.6,62.95 v86.6,61.5 | LED77.A arc-90 86.6,57.87 v86.5,56.5 | LED87.A arc-90 86.6,52.79 v86.6,51.4 | LED97.A arc-90 86.6,47.71 v86.5,46.2
  Bottom 0.254: SV5.7 66.39,86.6 67.9,86.6 68.3,87 68.3,97.3 69.7,98.2 86.3,98.2 86.6,97.8 v86.6,92 v86.6,86.8 v86.6,81.7 v86.6,76.7 v86.6,71.7 v86.6,66.6 v86.6,61.5 v86.5,56.5 v86.6,51.4 v86.5,46.2
L8  (via drill 0.6)
  Top 0.254: SV5.8 66.39,89.4 88.9,89.4 89.11,89.19 LED18.A arc90 89,88.28 v89,86.8 | LED28.A arc90 LED28.A v89.1,81.7 | LED38.A arc90 LED38.A v89.1,76.7 | LED48.A arc90 LED48.A v89.1,71.6 | LED58.A arc90 89,67.95 v89,66.5 | LED68.A arc90 LED68.A v89.1,61.6 | LED78.A arc90 89,57.8 v89,56.5 | LED88.A arc90 LED88.A v89.1,51.4 | LED98.A arc90 89,47.63 v88.9,46.3 | v89.1,91.9 LED8.A
  Bottom 0.254: v89.1,91.9 89.1,86.9 arc-90 v89,86.8 89,81.8 arc90 v89.1,81.7 v89.1,76.7 v89.1,71.6 89.1,66.6 arc-90 v89,66.5 89,61.7 arc90 v89.1,61.6 89.1,56.6 arc-90 v89,56.5 89,51.5 arc90 v89.1,51.4 89,46.6 arc-90 v88.9,46.3
L9  (via drill 0.6)
  Top 0.254: v91.7,92 91.65,92.05 LED9.A | SV5.9 64.2,93.88 64.2,96.3 65.3,98.2 89.9,98.2 90.3,97.8 v91.6,97.8 | LED19.A arc90 91.6,88.33 v91.6,87 | LED29.A arc90 91.6,83.25 v91.6,81.8 | LED39.A arc90 91.5,78.08 v91.5,76.7 | LED49.A arc90 91.6,73.09 v91.6,71.8 | LED59.A arc-90 91.7,68.01 v91.7,66.7 | 91.6,61.8 91.6,62.94 arc-90 LED69.A arc-90 91.7,62.93 v91.7,61.5 | LED79.A arc90 91.6,57.85 v91.6,56.4 | LED89.A arc-90 91.7,52.77 v91.7,51.3 | LED99.A arc-90 91.7,47.69 v91.7,46.4
  Bottom 0.254: v91.6,97.8 91.7,97.7 v91.7,92 91.7,87.1 arc-90 v91.6,87 v91.6,81.8 91.6,76.5 arc-90 v91.5,76.7 91.5,71.9 arc90 v91.6,71.8 91.6,66.8 arc90 v91.7,66.7 v91.7,61.5 91.7,56.5 arc-90 v91.6,56.4 91.6,51.4 arc90 v91.7,51.3 v91.7,46.4
L10  (via drill 0.6)
  Top 0.254: SV5.10 66.22,94.5 93,94.5 94.04,93.46 LED10.A v94.2,92.1 | LED20.A arc90 LED20.A 94.19,87.69 v93.5,87 | 94.1,83.22 arc-90 LED30.A 94.19,82.89 v93.2,81.9 | LED50.A 94.19,71.71 arc90 v94.2,71.7 | LED60.A 94.19,66.41 arc90 v94.2,66.4 | LED70.A 94.19,61.71 arc90 v94.3,61.6 | LED80.A 94.19,56.41 arc90 v94.2,56.4 | LED90.A 94.19,51.31 arc90 v94.2,51.3 | LED100.A 94.19,46.41 arc90 v94.2,46.4 | v93.5,76.7 94.19,77.19 LED40.A
  Bottom 0.254: v94.2,46.4 v94.2,51.3 v94.2,56.4 94.2,61.5 arc-90 v94.3,61.6 94.3,66.3 arc90 v94.2,66.4 v94.2,71.7 93.5,72.4 v93.5,76.7 93.3,76.7 93,77 93,81.7 v93.2,81.9 93.2,86.7 v93.5,87 93.5,87.5 94,88 94,91.9 v94.2,92.1 | 93.4,76.6 93.5,76.6
  Bottom 0.406: v93.5,76.7 93.4,76.7 93.4,76.6
MISO
  Bottom 0.406: IC1.2 36.48,23.52 45.34,23.62 50.44,29.12 52.84,29.12 59.28,35.56 SV1.3
MOSI
  Bottom 0.406: IC1.1 36.58,24.62 44.44,24.62 49.84,30.02 52.54,30.02 60.62,38.1 SV1.2
N$1  (via drill 0.6)
  Top 0.254: v20.32,27.94 45.64,27.94 48.6,30.9 50.1,30.9 53.7,34.5 53.7,35.45 R5.1
  Bottom 0.406: IC1.30 23.14,21.92 21.34,23.72 21.34,26.92 v20.32,27.94
N$2  (via drill 0.6)
  Top 0.254: R13.1 53.59,54.87 53.34,54.61 49.53,54.61 46.99,57.15 46.99,59.69 45.72,60.96 v40.38,60.96
  Bottom 0.406: IC1.43 33.68,54.26 v40.38,60.96
N$3  (via drill 0.6)
  Top 0.254: R14.1 53.59,57.41 53.34,57.15 49.53,57.15 48.26,58.42 48.26,60.96 46.99,62.23 39.37,62.23 v38.1,60.96
  Bottom 0.406: IC1.42 32.88,55.74 v38.1,60.96
N$4  (via drill 0.5)
  Top 0.254: R15.1 15.24,56.9 15.24,58.42 17.78,60.96 21.59,60.96 25.4,64.77 33.02,64.77 34.8,62.99 v34.8,62.7
  Bottom 0.254: v34.8,62.7 35.56,61.94 35.56,60.96
  Bottom 0.406: IC1.41 32.08,57.48 35.56,60.96
N$5  (via drill 0.5)
  Top 0.254: R2.1 53.7,37.99 53.7,36.9 48.3,36.9 41.12,29.72 v22.24,29.72
  Bottom 0.406: IC1.31 23.54,22.72 22.24,24.02 v22.24,29.72
N$6  (via drill 0.6)
  Top 0.254: R4.1 53.59,39.62 53.34,39.37 34.29,39.37 31.75,36.83 30.48,36.83 25.17,31.52 v22.73,31.52
  Bottom 0.254: v22.73,31.52 22.73,31.03 23.44,30.32 23.4,30.28 23.4,23.7 23.58,23.52 IC1.32
N$7
  Bottom 0.406: IC1.33 24.68,32.47 24.13,33.02 R1.2
N$8  (via drill 0.5)
  Top 0.254: R6.1 53.7,43.08 53.7,42 48.3,42 34.12,55.88 30.48,55.88 26.67,59.69 v25.4,59.69
  Bottom 0.406: IC1.34 26.48,52.26 25.4,53.34 v25.4,59.69
N$9
  Bottom 0.406: C2.1 44.38,8.48 Q2.1 41.91,10.96 41.91,15.24 38.43,18.72 IC1.8
N$10
  Bottom 0.406: C1.1 49.13,15.99 Q2.2 46.99,19.52 IC1.7
N$11  (via drill 0.5)
  Top 0.254: R7.1 53.7,45.62 53.7,44.7 53.4,44.4 48.9,44.4 36.15,57.15 30.48,57.15 26.77,60.86 v26.47,60.86
  Bottom 0.254: 27.28,59.08 26.47,59.89 v26.47,60.86
  Bottom 0.406: IC1.35 27.28,59.08
N$12  (via drill 0.5)
  Top 0.254: R8.1 53.7,48.16 53.7,47.4 53.4,47.1 48.6,47.1 36.9,58.8 32.08,58.8 31.19,59.69 29.21,59.69 27.83,61.07 v27.83,61.2
  Bottom 0.254: 28.08,60.82 27.83,61.07 v27.83,61.2
  Bottom 0.406: IC1.36 28.08,60.82
N$13
  Bottom 0.61: IC2.1 15.24,39.65 15.24,35.56 13.97,34.29 7.62,34.29 SV2.1
N$14  (via drill 0.5)
  Top 0.254: R9.1 53.7,50.7 53.7,49.5 48.6,49.5 42,56.1 42,58.2 40.5,59.7 34.5,59.7 33.07,61.13 v29.93,61.13
  Bottom 0.254: 28.88,59.36 28.88,60.08 v29.93,61.13
  Bottom 0.406: IC1.37 28.88,59.36
N$15
  Bottom 0.406: IC1.12 35.56,13.44 35.56,12.7 37.44,10.82 S2.P$2
N$16  (via drill 0.5)
  Top 0.254: R10.1 53.59,52.33 53.34,52.07 48.26,52.07 45.72,54.61 45.72,57.15 v43.18,59.69
  Bottom 0.254: 34.48,53.53 40.64,59.69 v43.18,59.69
  Bottom 0.406: IC1.44 34.48,53.53
N$17  (via drill 0.6)
  Top 0.254: R11.1 16.2,45.66 16.2,44.7 16.5,44.4 24.9,44.4 25.8,43.5 25.8,35.4 23.7,33.3 20.7,33.3 17.78,30.38 17.78,27.94 18.3,27.42 18.3,25.8 25.2,18.9 25.2,15.9 31.2,9.9 31.2,6 33,4.2 34.8,4.2 35.56,4.96 v35.56,6.35
  Bottom 0.254: 31.54,12.62 32.38,12.62 34.2,10.8 34.2,7.71 v35.56,6.35
  Bottom 0.406: IC1.16 31.24,14.48 31.24,12.92 31.54,12.62
N$18  (via drill 0.6)
  Top 0.254: R12.1 16.2,48.2 16.2,47.1 21,47.1 22.38,45.72 25.4,45.72 26.67,44.45 26.67,34.29 24.78,32.4 21.3,32.4 19.05,30.15 19.05,26.67 26.1,19.62 26.1,16.2 34.68,7.62 v38.1,7.62
  Bottom 0.406: IC1.15 32.14,14.46 32.14,13.52 32.44,13.22 33.64,13.22 35.44,11.42 35.44,8.42 36.04,7.82 37.9,7.82 v38.1,7.62
N$19  (via drill 0.5)
  Top 0.254: R16.1 16.2,58.37 16.2,57.3 23.1,57.3 24.3,58.5 24.3,61.8 26,63.5 v30.48,63.5
  Bottom 0.254: v30.48,63.5 33.02,63.5 33.02,60.96 31.28,59.22
  Bottom 0.406: IC1.40 31.28,59.22
N$20  (via drill 0.6)
  Top 0.254: R17.1 13.97,38.35 13.97,27.94 15.9,26.01 15.9,22.2 15.24,21.54 v15.24,20.32
  Bottom 0.406: IC1.26 16.84,18.72 v15.24,20.32
N$21  (via drill 0.6)
  Top 0.254: R18.1 11.43,38.35 11.43,29.21 15.24,25.4 15.24,22.86 12.94,20.56 v12.94,19.52
  Bottom 0.406: IC1.25 17.92,17.92 17.78,17.78 14.68,17.78 v12.94,19.52
N$22  (via drill 0.5)
  Top 0.254: R19.1 15.9,35.2 15.9,29.1 17.4,27.6 17.4,24.6 20.4,21.6 v20.4,16.8
  Bottom 0.254: v20.4,16.8 22.8,16.8 23.12,17.12 IC1.24
N$23  (via drill 0.5)
  Top 0.254: R20.1 15.24,37.09 15.24,27.94 16.51,26.67 16.51,24.13 19.05,21.59 19.05,16.51 20.32,15.24 v22.86,15.24
  Bottom 0.254: v22.86,15.24 23.94,16.32 IC1.23
N$24  (via drill 0.6)
  Top 0.254: R21.1 10.16,44.7 10.16,38.1 8.89,36.83 8.89,29.21 10.16,27.94 11.43,27.94 12.7,26.67 12.7,21.59 11.43,20.32 11.43,19.05 17.78,12.7 20.32,12.7 21.06,13.44 v22.79,13.44
  Bottom 0.406: IC1.22 25.47,13.51 25.4,13.51 v22.79,13.44
N$25  (via drill 0.6)
  Top 0.254: R22.1 9.9,46.99 6.35,46.99 5.08,45.72 5.08,35.56 7.62,33.02 7.62,19.05 8.89,17.78 11.43,17.78 17.55,11.66 v22.84,11.66
  Bottom 0.406: IC1.21 27.28,13.31 25.4,11.43 23.07,11.43 v22.84,11.66
N$26
  cutout Bottom: 38.77,9.93 40.64,12.7 40.64,15.24 34.29,17.78 34.29,20.32 49.16,21.22 54.24,16.14 53.34,13.97 46.69,7.92 41.31,7.39
N$27
  cutout Top: 38.77,9.93 40.64,12.7 40.64,15.24 34.29,17.78 34.29,20.32 49.16,21.22 54.24,16.14 53.34,13.97 46.69,7.92 41.31,7.39
N$28
  cutout Top: 62,67 62,54 66.6,47.4 67.4,42.8 67.7,42.9 67.7,67.6 61.9,67.6 61.9,66.4
N$29
  cutout Bottom: 62,67 61.9,54.4 66.6,47.4 66.8,67.6 62,67.7 62,66.8
N$30
  Top 0.254: SV3.1 R5.2
N$31
  Top 0.254: SV3.2 R2.2
N$32
  Top 0.254: SV3.3 R4.2
N$33
  Top 0.254: R6.2 SV3.4
N$34
  Top 0.254: R7.2 SV3.5
N$35
  Top 0.254: R8.2 SV3.6
N$36
  Top 0.254: R9.2 SV3.7
N$37
  Top 0.254: SV3.8 R10.2
N$38
  Top 0.254: R13.2 SV3.9
N$39
  Top 0.254: R14.2 SV3.10
N$40
  Top 0.254: R15.2 SV4.9
N$41
  Top 0.254: R16.2 SV4.10
N$42
  Top 0.254: R17.2 SV4.3
N$43
  Top 0.254: R18.2 SV4.4
N$44
  Top 0.254: R19.2 SV4.1
N$45
  Top 0.254: R20.2 SV4.2
N$46
  Top 0.254: R21.2 SV4.7
N$47
  Top 0.254: R22.2 SV4.8
N$48
  Top 0.254: R11.2 SV4.5
N$49
  Top 0.254: R12.2 SV4.6
N$51
  cutout Bottom: 26.67,24.13 26.67,16.51 34.29,16.51 34.29,24.13
N$52
  cutout Top: 26.67,24.13 26.67,16.51 34.29,16.51 34.29,24.13
R1
  Top 0.254: LED51.C LED52.C LED53.C LED54.C LED55.C LED56.C LED57.C LED58.C LED59.C LED60.C 94.86,70.16 95.3,70.6 95.3,72 96,72.7 96,80.2 96.2,80.4 96.58,80.4 SV7.6
R2
  Top 0.254: SV7.10 97,70.66 97,65 96,64 96,61 95,60 LED80.C LED79.C LED78.C LED77.C | LED71.C LED72.C | LED72.C 74,60 LED72.C | LED72.C LED73.C LED74.C LED75.C LED76.C LED77.C | LED77.C 87,60 LED77.C
R3
  Top 0.254: 71.33,75.46 LED41.C LED42.C LED43.C LED44.C LED45.C LED46.C LED47.C LED48.C LED49.C LED50.C 94.19,75.89 95.3,77 95.3,81 95.8,81.5 95.8,84 96.1,84.3 97.94,84.3 SV7.5
R4
  Top 0.254: SV7.9 98,74 96,72 96,66 95.08,65.08 LED70.C LED69.C LED68.C LED67.C LED66.C LED65.C LED64.C LED63.C LED62.C | LED61.C LED62.C | LED62.C 73.92,65.08 74,65 73.95,65 LED62.C
R5
  Top 0.254: SV7.2 95.68,91.97 LED20.C LED19.C LED18.C LED17.C LED16.C LED15.C LED14.C LED13.C | LED11.C LED12.C LED13.C | LED13.C 76.52,90.48 arc-90 77,90
R6
  Top 0.254: SV7.4 95.9,86.9 95.3,86.3 95.3,82.4 94.19,81.29 LED40.C LED39.C 91.33,80 90,80 89.68,80.32 LED38.C LED37.C LED36.C LED35.C LED34.C LED33.C LED32.C LED31.C
R7
  Top 0.254: LED1.C LED2.C LED3.C LED4.C LED5.C | 82.19,95.56 LED6.C LED7.C LED8.C LED9.C LED10.C 96.95,95.56 SV7.1
  Top 0.406: 82.19,95.5 82.19,95.56 LED5.C 81.49,95.5
R8
  Top 0.254: 89.11,85.62 LED28.C | SV7.3 97.43,89.43 94,86 94,85.59 LED30.C LED29.C LED28.C | LED21.C LED22.C LED23.C LED24.C LED25.C LED26.C LED27.C LED28.C
R9
  Top 0.254: SV7.8 98.27,76.73 99.9,75.2 99.9,70 97.8,67.9 97.8,55.6 96.5,54.3 94.81,54.3 LED90.C LED89.C LED88.C LED87.C LED86.C LED85.C LED84.C LED83.C LED82.C LED81.C
R10  (via drill 0.6)
  Top 0.254: v99,67 99,55 97,53 97,51 95.84,49.84 LED100.C LED99.C LED98.C LED97.C LED96.C LED95.C LED94.C LED93.C LED92.C LED91.C
  Bottom 0.254: SV7.7 100,77.27 100,69 99,68 v99,67
RST
  Bottom 0.254: 62.23,30.48 62.23,30.11 R3.1
  Bottom 0.406: IC1.4 46.05,21.92 50.8,26.67 54.61,26.67 | 54.61,26.67 C4.+ 58.42,30.48 SV1.5 62.23,30.48 | 54.61,26.67 54.61,19.68 S1.P$1
SCL  (via drill 0.6)
  Bottom 0.406: 28.84,14.56 IC1.19 28.88,7.95 v29.21,7.62 | 28.84,14.56 28.84,15.32 30.64,17.12 IC1.10 | 28.84,14.56 28.84,7.99 v29.21,7.62 | v29.21,7.62 29.21,5.08 22.86,5.08 10.16,17.78 10.16,21.22 SV6.3
SDA  (via drill 0.6)
  Top 0.406: 9.87,24.09 SV6.2 9.79,24.13
  Bottom 0.406: IC1.9 36.18,18.02 30.34,18.02 28.08,15.76 IC1.20 28.08,6.49 v27.94,6.35 22.86,6.35 11.43,17.78 11.43,20.32 12.7,21.59 12.7,22.86 11.47,24.09 SV6.2
VC  (via drill 0.5, 0.6)
  Top 0.254: v12.7,30.48 12.7,31.75 | 30.48,3.81 29.21,3.81
  Top 0.61: v12.7,36.83 12.7,35.56 | v32.7,23.1 32.7,25.2 | v38.1,3.81 39.37,3.81
  Bottom 0.254: R3.2 62.9,28.61 62.23,27.94 SV1.6 | R1.1 v12.7,30.48 12.7,29.21 13.97,27.94 v13.97,24.13 | 30.48,12.7 31.48,11.7 | 26.74,19.52 29.42,22.2 30,22.2 31.2,21 31.5,21 | 33.04,10.82 33.04,10.18 33.02,10.16 33.04,10.16 33.3,9.9 33.3,5.76 v33.34,5.72
  Bottom 0.406: 29.68,22.46 26.74,19.52 IC1.27 18.58,19.52 v13.97,24.13 | 29.68,22.46 IC1.38 | 29.68,22.46 31.02,21.12 IC1.5 | IC1.17 30.48,12.7 31.46,11.72 32.14,11.72 33.04,10.82
  Bottom 0.61: IC2.2 12.7,39.65 v12.7,36.83 | 31.5,21 32.7,22.2 v32.7,23.1 | v33.34,5.72 35.25,3.81 v38.1,3.81
  pour Top (isolate 0.406): 2.54,0 2.54,67.31 67.31,67.31 67.31,0

### Text on the board
tPlace: PART_LIST(JRT server connection required) | D:/lili/Pictures/veralpha.bmp
bPlace: S2 | S1 | R14 | R16 | R13 | R15 | R10 | R22 | R9 | R21 | R8 | R12 | S1 | S2 | R7 | R11 | R6 | 7805 | R18 | R4 | R17 | R2 | R20 | R5 | R19 | R1 | R3 | C4 | S1 | C1 | C2 | S2